# Altium schematic sheet Power_Supplies.SchDoc: Power supply
size 420 x 297 mm; EDA_Number: ARTIQ; Author: G.Kasprowicz; CompanyName: WUT ISE; DrawnBy: G.Kasprowicz; Organization: WUT ISE; Address1: PW ISE; Address2: Nowowiejska 15/19 00-665 Warsaw; Address3: gkasprow@gmail.com; Revision: 2; SheetNumber: -; SheetTotal: -; ModifiedBy: -; CheckedDate: -; Title2: Thermometers; DivGrp: WUT ISE; Designer: G.Kasprowicz; ModifiedDate: -; ProjectName: Sensor Box
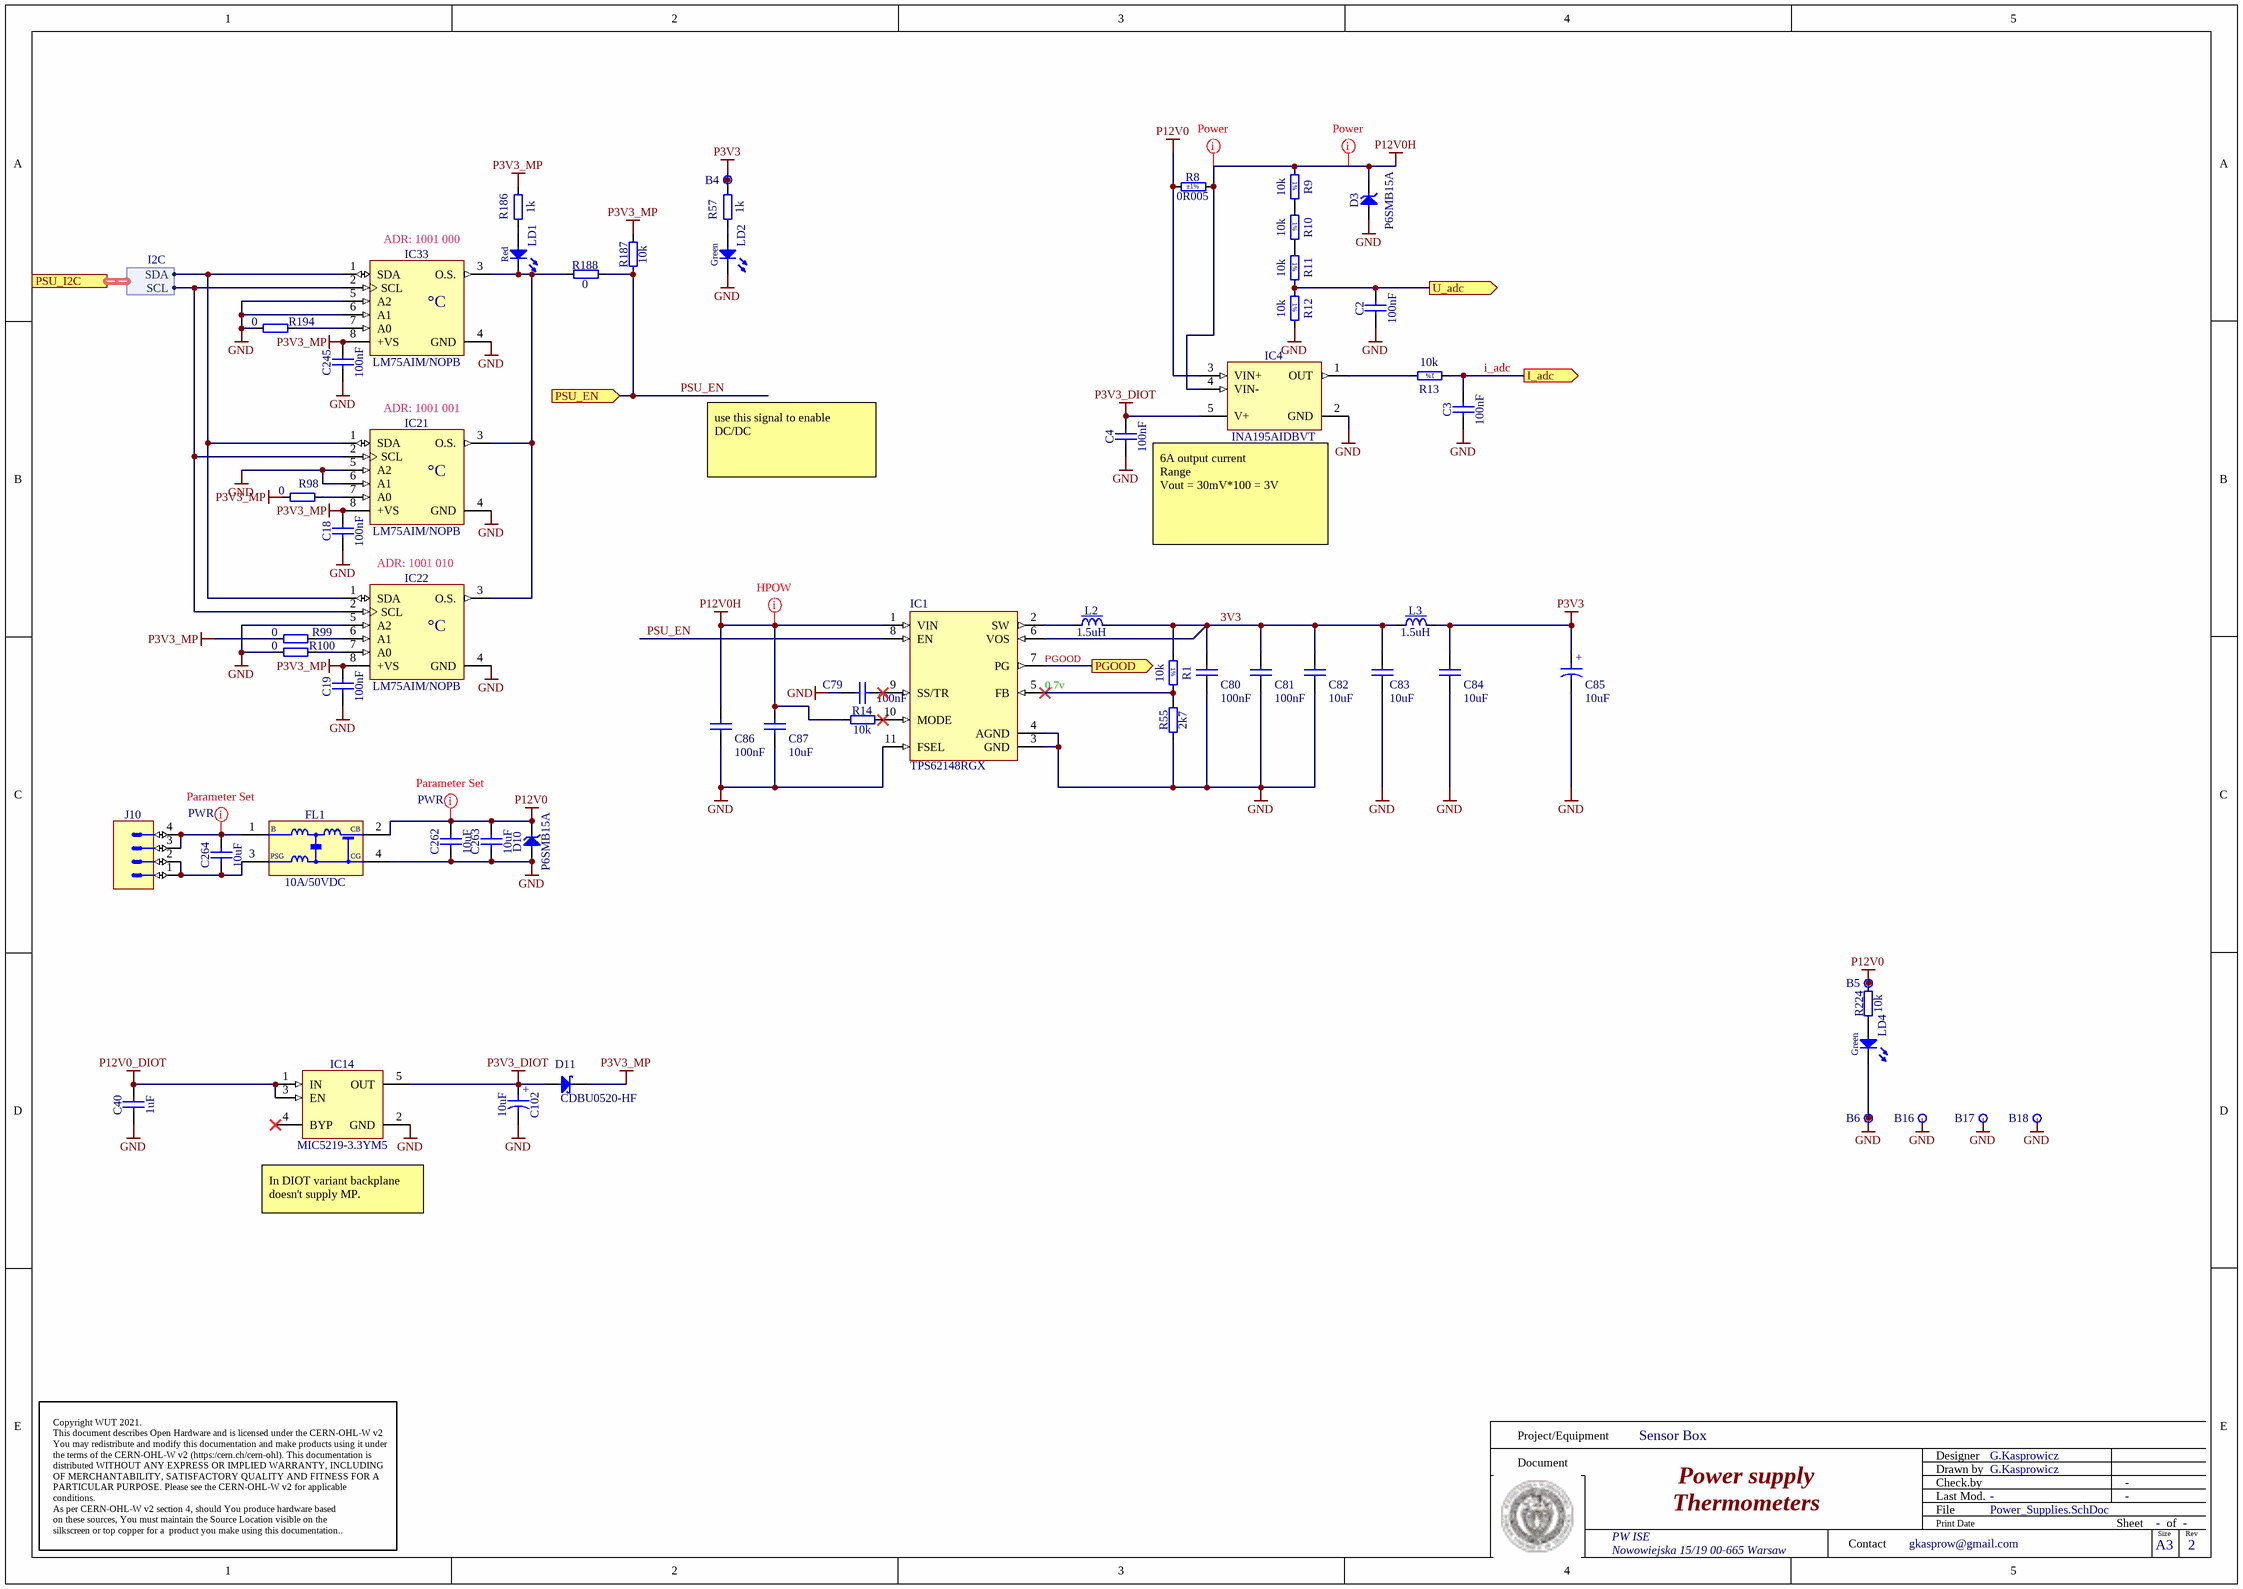
[diagram p0: Power_Supplies.SchDoc]

## Parts
B4  Plated Hole  [c150h50]  (value not drawn)  (no BOM)
B5  Plated Hole  [c150h50]  (value not drawn)  (no BOM)
B6  Plated Hole  [c150h50]  (value not drawn)  (no BOM)
B16  Plated Hole  [c150h50]  (value not drawn)  (no BOM)
B17  Plated Hole  [c150h50]  (value not drawn)  (no BOM)
B18  Plated Hole  [c150h50]  (value not drawn)  (no BOM)
C2  100nF  [CAPC1005X55N]
C3  100nF  [CAPC1005X55N]
C4  100nF  [CAPC1005X55N]
C18  100nF  [CAPC1005X55N]
C19  100nF  [CAPC1005X55N]
C40  1uF  [CAPC1608X87N]
C79  100nF  [CAPC1005X55N]
C80  100nF  [CAPC1005X55N]
C81  100nF  [CAPC1005X55N]
C82  10uF  [CAPC2012X95N]
C83  10uF  [CAPC2012X95N]
C84  10uF  [CAPC2012X95N]
C85  10uF  [CAPMP3216X180N]
C86  100nF  [CAPC1005X55N]
C87  10uF  [CAPC2012X95N]
C102  10uF  [CAPMP3216X180N]
C245  100nF  [CAPC1005X55N]
C262  10uF  [CAPC2012X95N]
C263  10uF  [CAPC2012X95N]
C264  10uF  [CAPC2012X95N]
D3  P6SMB15A  [DIOM5436X261N]
D10  P6SMB15A  [DIOM5436X261N]
D11  CDBU0520-HF  [SOD-523F]
FL1  10A/50VDC  [FIL_MURATA_BNX02]
IC1  TPS62148RGX  [TEXAS_RGX0011A]
IC4  INA195AIDBVT  [SOT95P280X145-5N]
IC14  MIC5219-3.3YM5  [SOT95P280X145-5N]
IC21  LM75AIM/NOPB  [SOIC127P600X175-8N]
IC22  LM75AIM/NOPB  [SOIC127P600X175-8N]
IC33  LM75AIM/NOPB  [SOIC127P600X175-8N]
J10  Mini-Fit Jr.™  [MOLEX_39-30-0040]  (value not drawn)
L2  1.5uH  [IND_WURTH_WE-LHMI_7050]
L3  1.5uH  [IND_WURTH_WE-LHMI_7050]
LD1  Red  [LED_AVAGO_HSMC-C120]
LD2  Green  [LED_AVAGO_HSME-C120]
LD4  Green  [LED_AVAGO_HSME-C120]
R1  10k  [RESC1005X40N]
R8  0R005  Tolerance: ±1%  [RES_SEI-CSNL2010_0R0031-0R1]
R9  10k  [RESC1005X40N]
R10  10k  [RESC1005X40N]
R11  10k  [RESC1005X40N]
R12  10k  [RESC1005X40N]
R13  10k  [RESC1005X40N]
R14  10k  [RESC1005X40N]
R55  2k7  [RESC1608X55N]
R57  1k  [RESC1608X55N]
R98  0  [RESC1005X40N]
R99  0  [RESC1005X40N]
R100  0  [RESC1005X40N]
R186  1k  [RESC1608X55N]
R187  10k  [RESC1005X40N]
R188  0  [RESC1005X40N]
R194  0  [RESC1005X40N]
R224  10k  [RESC1005X40N]

## Ports
I_adc (out), PGOOD (out), PSU_EN (in), PSU_I2C (harness I2C), U_adc (out)

## Harnesses
I2C: SDA, SCL

## Nets
GND: B6.1 B16.1 B17.1 B18.1 C2.1 C3.1 C4.1 C18.1 C19.1 C40.1 C79.1 C80.1 C81.1 C82.1 C83.1 C84.1 C85.2 C86.1 C87.1 C102.2 C245.1 C262.1 C263.1 D3.2(A) D10.2(A) FL1.4(CG) IC1.3(GND) IC1.4(AGND) IC1.11(FSEL) IC4.2(GND) IC14.2(GND) IC21.4(GND) IC21.5(A2) IC21.6(A1) IC22.4(GND) IC22.5(A2) IC33.4(GND) IC33.5(A2) IC33.6(A1) LD2.1(C) LD4.1(C) R12.2 R55.1 R100.1 R194.1
P3V3: B4.1 C84.2 C85.1 L3.2 R57.2
P3V3_DIOT: C4.2 C102.1 D11.2(A) IC4.5(V+) IC14.5(OUT)
P3V3_MP: C18.2 C19.2 C245.2 D11.1(C) IC21.8(+VS) IC22.8(+VS) IC33.8(+VS) R98.1 R99.1 R186.2 R187.2
P12V0: B5.1 C262.2 C263.2 D10.1(C) FL1.2(CB) IC4.3(VIN+) R8.1 R224.2
P12V0_DIOT: C40.2 IC14.1(IN) IC14.3(EN)
P12V0H: C86.2 C87.2 D3.1(C) IC1.1(VIN) IC4.4(VIN-) R8.2 R9.1 R14.1
3V3: C80.2 C81.2 C82.2 C83.2 IC1.6(VOS) L2.2 L3.1 R1.1
i_adc: C3.2 R13.1 ; port I_adc
PGOOD: IC1.7(PG) ; port PGOOD
PSU_EN: IC1.8(EN) R187.1 R188.2 ; port PSU_EN
U_adc: C2.2 R11.2 R12.1 ; port U_adc
NetC79_2: C79.2 IC1.9(SS/TR)
NetC264_1: C264.1 FL1.3(PSG) J10.1 J10.2
NetC264_2: C264.2 FL1.1(B) J10.3 J10.4
NetIC1_2: IC1.2(SW) L2.1
NetIC1_5: IC1.5(FB) R1.2 R55.2
NetIC1_10: IC1.10(MODE) R14.2
NetIC4_1: IC4.1(OUT) R13.2
NetIC21_1: IC21.1(SDA) IC22.1(SDA) IC33.1(SDA) ; port PSU_I2C.SDA
NetIC21_2: IC21.2(SCL) IC22.2(SCL) IC33.2(SCL) ; port PSU_I2C.SCL
NetIC21_3: IC21.3(O.S.) IC22.3(O.S.) IC33.3(O.S.) LD1.1(C) R188.1
NetIC21_7: IC21.7(A0) R98.2
NetIC22_6: IC22.6(A1) R99.2
NetIC22_7: IC22.7(A0) R100.2
NetIC33_7: IC33.7(A0) R194.2
NetLD1_2: LD1.2(A) R186.1
NetLD2_2: LD2.2(A) R57.1
NetLD4_2: LD4.2(A) R224.1
NetR9_2: R9.2 R10.1
NetR10_2: R10.2 R11.1

Not connected (* = marked no-connect by the designer): IC14 4(BYP)*

## Layout directives
net class PWR: NetC264_2, P12V0
net class HPOW: P12V0H
net class Power: P12V0H

## Notes on the sheet
- (near IC33) ADR: 1001 000
- (near IC21) ADR: 1001 001
- use this signal to enable DC/DC
- ADR: 1001 010
- 6A output current
  Range
  Vout = 30mV*100 = 3V
- (near IC1) 0.7v
- (near IC14) In DIOT variant backplane doesn't supply MP.
- Project/Equipment
- Document
- Designer
- Drawn by
- Check.by
- Contact
- File
- Last Mod.
- Print Date
- Sheet
- Size
- A3
- of
- Rev
- Copyright WUT 2021.
  This document describes Open Hardware and is licensed under the CERN-OHL-W v2
  You may redistribute and modify this documentation and make products using it under the terms of the CERN-OHL-W v2 (https:/cern.ch/cern-ohl). This documentation is distributed WITHOUT ANY EXPRESS OR IMPLIED WARRANTY, INCLUDING OF MERCHANTABILITY, SATISFACTORY QUALITY AND FITNESS FOR A PARTICULAR PURPOSE. Please see the CERN-OHL-W v2 for applicable conditions.
  As per CERN-OHL-W v2 section 4, should You produce hardware based
  on these sources, You must maintain the Source Location visible on the
  silkscreen or top copper for a  product you make using this documentation..
- (in symbol CTE3216-18_10UF_16V_20%_AVX_TCJ) +
- (in symbol LM75AIM/NOPB) °C
- (in symbol R0402_10K_1%_0.0625W_100PPM) 1%

## Library data of the parts
B4-B6 B16-B18 = PLATED_HOLE0.5_PAD1.5: Single Terminal Socket; Part Description: Plated Through Hole: Hole Dia.=0.5mm Pad Dia.=1.5mm; Mounted: No; Part Number: PLATED_HOLE0.5_PAD1.5; Component Type: Standard (No BOM); Pin Count: 1; Family: Plated Hole; Socket: No; SMD: No; Sense: No; Status: None; ComponentHeight: 0mm; HelpURL: Undefined; Author: CERN DEM MR; CreateDate: 12.10.2017; LatestRevisionDate: 12.10.2017; PackageDescription: Plated Through Hole: Hole Dia.=0.5mm Pad Dia.=1.5mm
C2-C4 C18 C19 C79-C81 C86 C245 = CC0402_100NF_50V_10%_X7R: Non-polarised capacitor; Part Description: SMD Multilayer Chip Ceramic Capacitor; Manufacturer: GENERIC; Manufacturer1 Part Number: GRM155R71H104KE14D; Voltage: 50V; TC: X7R; Tolerance: ±10%; Part Number: CC0402_100NF_50V_10%_X7R; Component Kind: Standard; Component Type: Standard; Pin Count: 2; Value: 100nF; Status: None; Manufacturer Part Number: CC0402_100NF_50V_10%_X7R; Case: 0402; Mounted: Yes; Socket: No; SMD: Yes; Sense: No; Manufacturer1 Example: MURATA; Manufacturer1 ComponentHeight: 0.55mm; HelpURL: \\cern.ch\dfs\Applications\Altium\Datasheets\CC0402_MURATA_GRM155R71H104KE14D.pdf; Author: CERN DEM MR; CreateDate: 30.06.2017; LatestRevisionDate: 30.06.2017
C40 = CC0603_1UF_25V_10%_X7R: Non-polarised capacitor; Part Description: SMD Multilayer Chip Ceramic Capacitor; Manufacturer: GENERIC; Manufacturer1 Part Number: GRM188R71E105KA12D; Voltage: 25V; TC: X7R; Tolerance: ±10%; Part Number: CC0603_1UF_25V_10%_X7R; Component Kind: Standard; Component Type: Standard; Pin Count: 2; Value: 1uF; Status: None; Manufacturer Part Number: CC0603_1UF_25V_10%_X7R; Case: 0603; Mounted: Yes; Socket: No; SMD: Yes; Sense: No; Manufacturer1 Example: MURATA; Manufacturer1 ComponentHeight: 0.9mm; HelpURL: \\cern.ch\dfs\Applications\Altium\Datasheets\CC0603_X7R_MURATA.pdf; Author: CERN DEM JLC; CreateDate: 18.01.2011; LatestRevisionDate: 18.01.2011
C82-C84 C87 C262-C264 = CC0805_10UF_25V_10%_X5R: Non-polarised capacitor; Part Description: SMD Multilayer Chip Ceramic Capacitor; Manufacturer: GENERIC; Manufacturer1 Part Number: GRM219R61E106KA12D; Voltage: 25V; TC: X5R; Tolerance: ±10%; Part Number: CC0805_10UF_25V_10%_X5R; Component Kind: Standard; Component Type: Standard; Pin Count: 2; Value: 10uF; Status: Preferred; Manufacturer Part Number: CC0805_10UF_25V_10%_X5R; Case: 0805; Mounted: Yes; Socket: No; SMD: Yes; Sense: No; Manufacturer1 Example: MURATA; Manufacturer1 ComponentHeight: 0.95mm; HelpURL: \\cern.ch\dfs\Applications\Altium\Datasheets\CC0805_X5R_MURATA_GRM.pdf; Author: CERN DEM JLC; CreateDate: 25.10.2012; LatestRevisionDate: 06.09.2016
C85 C102 = CTE3216-18_10UF_16V_20%_AVX_TCJ: Polarised capacitor; Part Description: ESR 0R200 Tantalum Solid Electrolytic Chip Capacitor with Conductive Polymer Electrode; Manufacturer: AVX; Manufacturer Part Number: TCJA106M016R0200; Voltage: 16V; Tolerance: ±20%; Part Number: CTE3216-18_10UF_16V_20%_AVX_TCJ; Component Kind: Standard; Component Type: Standard; Pin Count: 2; Value: 10uF; Status: Preferred; Case: A; Mounted: Yes; Socket: No; SMD: Yes; Sense: No; ComponentHeight: 1.8mm; HelpURL: \\cern.ch\dfs\Applications\Altium\Datasheets\CTE_AVX_TCJ.pdf; Author: CERN DEM JLC; CreateDate: 29.03.2012; LatestRevisionDate: 29.03.2012
D3 D10 = P6SMB15A: Transient Voltage Suppressor Diode (Uni-Directional); Part Description: Uni-directional Transient Voltage Suppressor (TVS) Diode; Manufacturer: LITTELFUSE; Voltage: 15V; Power: 600W; PressFit: No; Bonding: No; Part Number: P6SMB15A; Component Kind: Standard; Component Type: Standard; Device: P6SMB15A; PackageDescription: DO-214-AA/SMB Diode, Molded Body; 5.40mm L X 3.62mm W X 2.61mm H, IPC Medium Density; Manufacturer Part Number: P6SMB15A; Pin Count: 2; Case: SMB; Mounted: Yes; Socket: No; SMD: Yes; Sense: No; ComponentHeight: 2.61mm; HelpURL: \\cern.ch\dfs\Applications\Altium\Datasheets\P6SMB15A.pdf; Author: CERN DEM JLC; CreateDate: 12.07.2017; LatestRevisionDate: 12.07.2017
D11 = CDBU0520-HF: Schottky Diode; Manufacturer: COMCHIP; Part Description: 20V Surface mount Schottky Barrier Diode; Voltage: 20V; Power: 500mA; PressFit: No; Bonding: No; Manufacturer Part Number: CDBU0520-HF; PackageDescription: Small Outline Diode Flat Lead (SOD-523F), Body; 1.80mm L X 1mm W X 0.85mm H; Part Number: CDBU0520-HF; Component Kind: Standard; Component Type: Standard; Device: CDBU0520-HF; Pin Count: 2; Case: SOD-523F; Mounted: Yes; Socket: No; SMD: Yes; Sense: No; ComponentHeight: 1mm; HelpURL: \\cern.ch\dfs\Applications\Altium\Datasheets\CDBU0520-HF.pdf; Author: CERN DEM HF; CreateDate: 13.10.2023; LatestRevisionDate: 13.10.2023
FL1 = FIL_MURATA_BNX022-01L: Block Type EMIFIL (LC Combined); Part Description: Block Type EMIFIL (LC Combined) SMD Type, BNX02* Series; Manufacturer: MURATA; Resistance: 0.5R; Part Number: FIL_MURATA_BNX022-01L; Component Kind: Standard; Component Type: Standard; Pin Count: 2; Value: 10A/50VDC; Status: None; Manufacturer Part Number: BNX022-01L; Mounted: Yes; Socket: No; SMD: Yes; Sense: No; ComponentHeight: 3.3mm; HelpURL: \\cern.ch\dfs\Applications\Altium\Datasheets\FIL_MURATA_BNX022-01L.pdf; Author: CERN DEM JLC; CreateDate: 10.10.2012; LatestRevisionDate: 10.10.2012
IC1 = TPS62148RGX: 3V-17V 2A Step-Down Converter, High Accuracy, With DCS-Control; Manufacturer: TEXAS INSTRUMENTS; PressFit: No; Bonding: No; Part Number: TPS62148RGX; Component Kind: Standard; Component Type: Standard; Device: TPS62148RGX; PackageDescription: TEXAS Case Style (R-VQFN-HR-N11), 0.50mm Pitch, 11 Pin, 2.00mm W X 3.00mm L X 1.00mm H body; Part Description: 3V-17V 2A Step-Down Converter, High Accuracy, with DCS-Control; Manufacturer Part Number: TPS62148RGX; Pin Count: 11; Case: QFN14; Mounted: Yes; Socket: No; SMD: Yes; Sense: No; ComponentHeight: 1mm; HelpURL: \\cern.ch\dfs\Applications\Altium\Datasheets\TPS62148RGX.pdf; Author: CERN DEM MR; CreateDate: 08.02.2019; LatestRevisionDate: 08.02.2019
IC4 = ADC_INA195AIDBVT: Current Shunt Monitor -16V to +80V Common-Mode Range; Manufacturer: TEXAS INSTRUMENTS; PressFit: No; Bonding: No; Part Number: INA195AIDBVT; Component Kind: Standard; Component Type: Standard; Device: INA195AIDBVT; PackageDescription: SOT, 0.95mm pitch; 5 pin, 1.60mm W X 2.90mm L X 1.45mm H body, IPC Medium Density; Part Description: Current Shunt Monitor -16V to +80V Common-Mode Range; Manufacturer Part Number: INA195AIDBVT; Pin Count: 5; Case: SOT23-5; Mounted: Yes; Socket: No; SMD: Yes; Sense: No; ComponentHeight: 1.45mm; Author: GK; HelpURL: \\cern.ch\dfs\Applications\Altium\Datasheets\INA194AIDBVT.pdf; CreateDate: 10.05.2010; LatestRevisionDate: 10.05.2010
IC14 = MIC5219-3.3YM5: 500mA Peak Output LDO Regulator; Part Description: 3.3V 500mA Peak Output Low Drop-Out  (LDO) Regulator; Manufacturer: MICROCHIP TECHNOLOGY; PressFit: No; Bonding: No; Part Number: MIC5219-3.3YM5; Component Kind: Standard; Component Type: Standard; Device: MIC5219-3.3YM5; PackageDescription: SOT, 0.95mm pitch; 5 pin, 1.60mm W X 2.90mm L X 1.45mm H body, IPC Medium Density; Manufacturer Part Number: MIC5219-3.3YM5; Pin Count: 5; Case: SOT23-5; Mounted: Yes; Socket: No; SMD: Yes; Sense: No; ComponentHeight: 1.45mm; HelpURL: \\cern.ch\dfs\Applications\Altium\Datasheets\MIC5219-3.3YM5.pdf; Author: CERN DEM WB; CreateDate: 2019-04-16; LatestRevisionDate: 2019-04-16
IC21 IC22 IC33 = LM75AIM/NOPB: Digital Temperature Sensor and Thermal Watchdog with Two-Wire Interface; Part Description: -25° to +100°C ±2°C Digital Temperature Sensor and Thermal Watchdog with Two-Wire Interface; Manufacturer: TEXAS INSTRUMENTS; PressFit: No; Bonding: No; Part Number: LM75AIM/NOPB; Component Kind: Standard; Component Type: Standard; Device: LM75AIM/NOPB; PackageDescription: SOIC 8, Pitch 1.27mm - Body 4x5mm, IPC Medium Density; Manufacturer Part Number: LM75AIM; Pin Count: 8; Case: SOIC8; Mounted: Yes; Socket: No; SMD: Yes; Sense: No; ComponentHeight: 1.75mm; HelpURL: \\cern.ch\dfs\Applications\Altium\Datasheets\LM75AIM-NOPB.pdf; Author: CERN DEM JLC; CreateDate: 15.10.2012; LatestRevisionDate: 01.06.2022
J10 = MOLEX_39-30-0040: Connector 4 Male; Part Description: 4.20mm (.165") Pitch Mini-Fit Jr. Header, Dual Row, Right Angle with Snap-in Plastic Peg PCB Lock, 4 Circuits; Manufacturer: MOLEX; PressFit: No; Part Number: MOLEX_39-30-0040; Component Kind: Standard; Component Type: Standard; Pin Count: 4; Family: Mini-Fit Jr.™; Mounted: Yes; Socket: No; SMD: No; Sense: No; Status: None; Manufacturer Part Number: 39-30-0040; ComponentHeight: 11.4mm; HelpURL: \\cern.ch\dfs\Applications\Altium\Datasheets\MOLEX_39-30-0040.pdf; Author: CERN DEM JLC; CreateDate: 2018-10-02; LatestRevisionDate: 2018-10-02
L2 L3 = IND_1.5UH_20%_WURTH_WE-LHMI_74437349015: Inductor With Core; Part Description: SMD Power Inductor (WE-LHMI Series); Manufacturer: WURTH ELEKTRONIK; Power: 8A; Resistance: 0.0086R; Tolerance: ±20%; Part Number: IND_1.5UH_20%_WURTH_WE-LHMI_74437349015; Component Kind: Standard; Component Type: Standard; Pin Count: 2; Value: 1.5uH; Manufacturer Part Number: 74437349015; Mounted: Yes; Socket: No; SMD: Yes; Sense: No; ComponentHeight: 5mm; HelpURL: \\cern.ch\dfs\Applications\Altium\Datasheets\IND_WURTH_WE-LHMI_74437349015.pdf; Author: CERN DEM MR; CreateDate: 27.05.2016; LatestRevisionDate: 27.05.2016
LD1 = LED_AVAGO_HSMC-C120: LED Red 1C 2A; Part Description: High Performance Right Angle Chip Red LED; Manufacturer: AVAGO TECHNOLOGIES; PressFit: No; Bonding: No; Part Number: LED_AVAGO_HSMC-C120; Component Kind: Standard; Component Type: Standard; Color: Red; PackageDescription: Red Chip LED, 2-Leads, Body 1.7x1.1mm, Side Emitting Package; Status: Not Recommended; Manufacturer Part Number: HSMC-C120; Pin Count: 2; Mounted: Yes; Socket: No; SMD: Yes; Sense: No; ComponentHeight: 0.7mm; HelpURL: \\cern.ch\dfs\Applications\Altium\Datasheets\LED_AVAGO_HSMC-C120.pdf; ComponentLink1URL: \\cern.ch\dfs\Applications\Altium\Datasheets\LED_AVAGO_HSMC-C120_DESIGN-GUIDE.pdf; ComponentLink1Description: Design Guide; Author: CERN DEM JMW; CreateDate: 22.07.2009; LatestRevisionDate: 20.06.2012
LD2 LD4 = LED_AVAGO_HSME-C120: LED Green 1C 2A; Part Description: High Performance Right Angle Chip Green LED; Manufacturer: AVAGO TECHNOLOGIES; PressFit: No; Bonding: No; Part Number: LED_AVAGO_HSME-C120; Component Kind: Standard; Component Type: Standard; Color: Green; PackageDescription: Green Chip LED, 2-Leads, Body 1.7x1.1mm, Side Emitting Package; Status: Not Recommended; Manufacturer Part Number: HSME-C120; Pin Count: 2; Mounted: Yes; Socket: No; SMD: Yes; Sense: No; ComponentHeight: 0.7mm; HelpURL: \\cern.ch\dfs\Applications\Altium\Datasheets\LED_AVAGO_HSME-C120.pdf; ComponentLink1URL: \\cern.ch\dfs\Applications\Altium\Datasheets\LED_AVAGO_HSME-C110_DESIGN-GUIDE.pdf; ComponentLink1Description: Design Guide; Author: CERN DEM JMW; CreateDate: 22.07.2009; LatestRevisionDate: 20.06.2012
R1 R9-R14 R187 R224 = R0402_10K_1%_0.0625W_100PPM: Resistor - 1%; Part Description: General Purpose Thick Film Chip Resistor; Manufacturer: GENERIC; Manufacturer1 Part Number: 232270671003L; TC: ±100ppm/°C; PressFit: No; Part Number: R0402_10K_1%_0.0625W_100PPM; Component Kind: Standard; Component Type: Standard; Pin Count: 2; Value: 10k; Status: Not Recommended; Power: 0.0625W; Tolerance: ±1%; Manufacturer Part Number: R0402_10K_1%_0.0625W_100PPM; Case: 0402; Mounted: Yes; Sense: No; Socket: No; SMD: Yes; Manufacturer1 Example: YAGEO PHYCOMP; Manufacturer1 ComponentHeight: 0.4mm; HelpURL: \\cern.ch\dfs\Applications\Altium\Datasheets\R0402_Phycomp_RC0402.pdf; Author: CERN DEM JLC
  R1 R9-R13: CreateDate: 03/12/2007; LatestRevisionDate: 17/10/2012
  R14 R187 R224: CreateDate: 03.12.2007; LatestRevisionDate: 17.10.2012
R8 = R2010_0R005_1%_1.5W_50PPM_SEI_CSNL: Resistor - 1%; Part Description: Power Thick Film Chip Resistor; Manufacturer: SEI (STACKPOLE ELECTRONICS INC.); Manufacturer Part Number: CSNL2010FT5L00; Power: 1.5W; TC: ±50ppm/°C; PressFit: No; Part Number: R2010_0R005_1%_1.5W_50PPM_SEI_CSNL; Component Kind: Standard; Component Type: Standard; Pin Count: 2; Value: 0R005; Status: None; Case: 2010; Mounted: Yes; Sense: No; Socket: No; SMD: Yes; ComponentHeight: 0.9mm; HelpURL: \\cern.ch\dfs\Applications\Altium\Datasheets\R2010_SEI_CSNL.pdf; Author: CERN DEM HF; CreateDate: 20.06.2024; LatestRevisionDate: 01.07.2024
R55 = R0603_2K7_1%_0.1W_100PPM: Resistor - 1%; Part Description: General Purpose Thick Film Chip Resistor; Manufacturer: GENERIC; Manufacturer1 Part Number: RC0603FR-072K7L; Power: 0.1W; TC: ±100ppm/°C; PressFit: No; Part Number: R0603_2K7_1%_0.1W_100PPM; Component Kind: Standard; Component Type: Standard; Pin Count: 2; Value: 2k7; Status: Preferred; Tolerance: ±1%; Manufacturer Part Number: R0603_2K7_1%_0.1W_100PPM; Case: 0603; Mounted: Yes; Sense: No; Socket: No; SMD: Yes; Manufacturer1 Example: YAGEO PHYCOMP; Manufacturer1 ComponentHeight: 0.55mm; HelpURL: \\cern.ch\dfs\Applications\Altium\Datasheets\R0603_PHYCOMP_RC0603.pdf; Author: CERN DEM JLC; CreateDate: 02.05.2011; LatestRevisionDate: 02.05.2011
R57 R186 = R0603_1K_1%_0.1W_100PPM: Resistor - 1%; Part Description: General Purpose Thick Film Chip Resistor; Manufacturer: GENERIC; Manufacturer1 Part Number: NRC06F1001TRF; Power: 0.1W; TC: ±100ppm/°C; PressFit: No; Part Number: R0603_1K_1%_0.1W_100PPM; Component Kind: Standard; Component Type: Standard; Pin Count: 2; Value: 1k; Status: Preferred; Tolerance: ±1%; Manufacturer Part Number: R0603_1K_1%_0.1W_100PPM; Case: 0603; Mounted: Yes; Sense: No; Socket: No; SMD: Yes; Manufacturer1 Example: NIC COMPONENT; Manufacturer1 ComponentHeight: 0.55mm; HelpURL: \\cern.ch\dfs\Applications\Altium\Datasheets\R0603_NIC_NRC.pdf; Author: CERN DEM JLC; CreateDate: 03.12.2007; LatestRevisionDate: 13.03.2008
R98-R100 R188 R194 = R0402_0R_JUMPER: Resistor; Part Description: 1A (0.05R Max DC Resistance) Zero Ohm Jumper; Manufacturer: GENERIC; Manufacturer1 Part Number: 232270591001L; Part Number: R0402_0R_JUMPER; Component Kind: Standard; Component Type: Standard; Pin Count: 2; Value: 0; Status: Not recommended; Manufacturer Part Number: R0402_0R_JUMPER; Case: 0402; Mounted: Yes; Sense: No; Socket: No; SMD: Yes; Manufacturer1 Example: YAGEO PHYCOMP; Manufacturer1 ComponentHeight: 0.4mm; HelpURL: \\cern.ch\dfs\Applications\Altium\Datasheets\R0402_Phycomp_RC0402.pdf; Author: CERN DEM JLC; CreateDate: 03.12.2007; LatestRevisionDate: 17.10.2012